# Altium schematic sheet PWR_SEPIC_P12V_N12V.SchDoc: RFSoC_AMC
size 420 x 297 mm; Author: T. Przywozki; CompanyName: WUT ISE; DrawnBy: T. Przywozki; Organization: WUT ISE; Address1: PW ISE; Address2: Nowowiejska 15/19 00-665 Warsaw; Revision: 1.0; SheetNumber: 34; ModifiedBy: -; CheckedDate: -; Title2: 8 channel ADC & DAC; DivGrp: WUT ISE; Designer: T. Przywozki
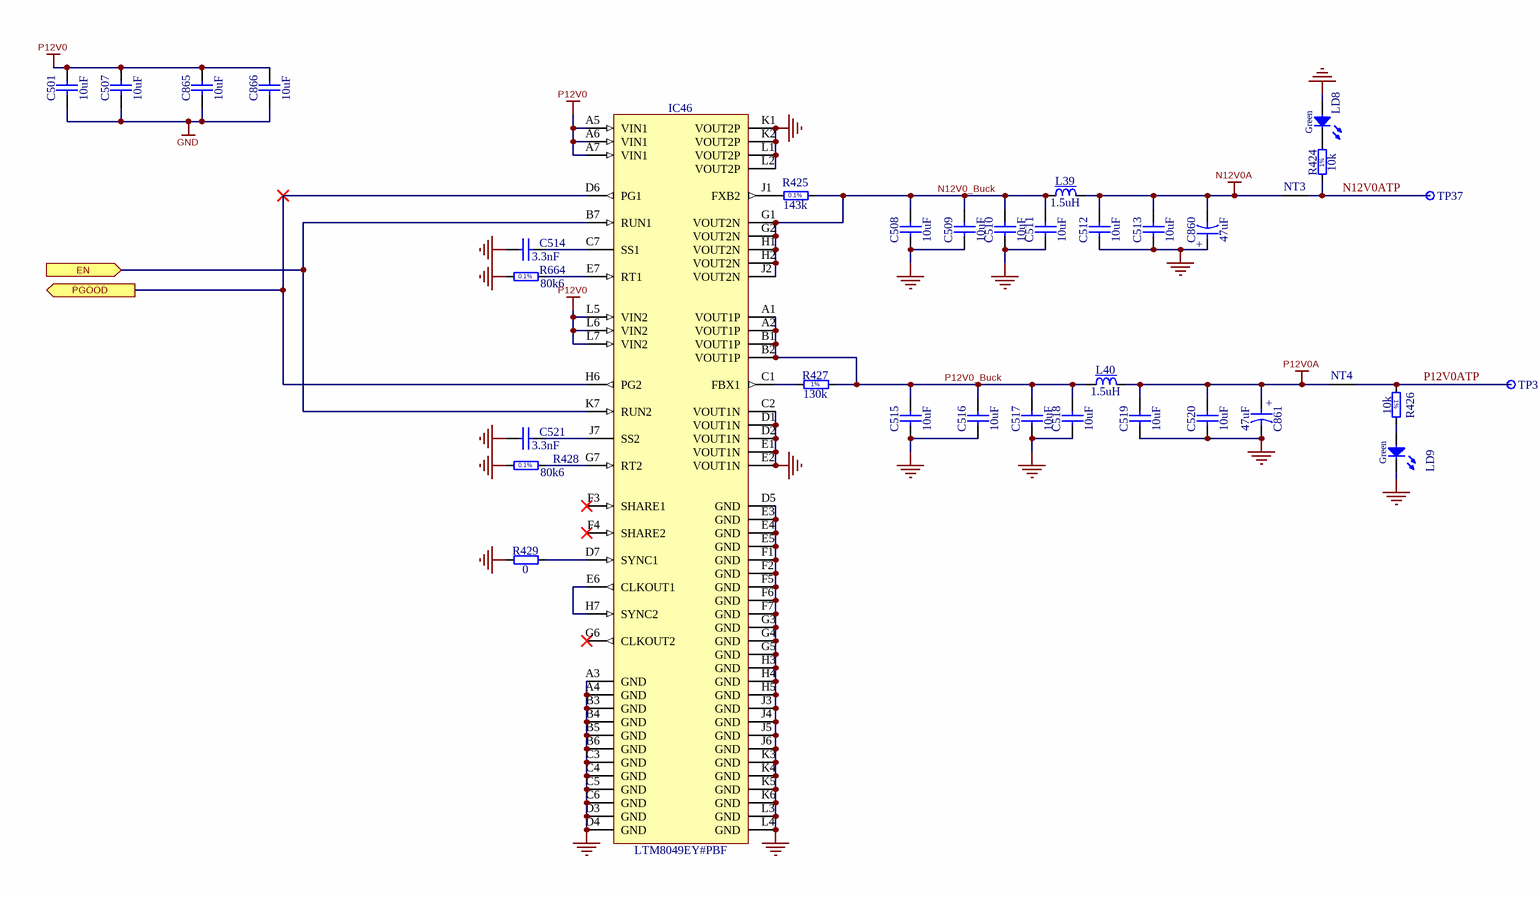
[diagram p0: PWR_SEPIC_P12V_N12V.SchDoc]

## Parts
C501  10uF  [CAPC2012X95N]
C507  10uF  [CAPC2012X95N]
C508  10uF  [CAPC2012X95N]
C509  10uF  [CAPC2012X95N]
C510  10uF  [CAPC2012X95N]
C511  10uF  [CAPC2012X95N]
C512  10uF  [CAPC2012X95N]
C513  10uF  [CAPC2012X95N]
C514  3.3nF  [CAPC1005X55N]
C515  10uF  [CAPC2012X95N]
C516  10uF  [CAPC2012X95N]
C517  10uF  [CAPC2012X95N]
C518  10uF  [CAPC2012X95N]
C519  10uF  [CAPC2012X95N]
C520  10uF  [CAPC2012X95N]
C521  3.3nF  [CAPC1005X55N]
C860  47uF  [CAPMP6032X280N]
C861  47uF  [CAPMP6032X280N]
C865  10uF  [CAPC2012X95N]
C866  10uF  [CAPC2012X95N]
IC46  LTM8049EY#PBF  [BGA77C127P7X11_900X1500X262]
L39  1.5uH  [IND_TDK_SPM6530]
L40  1.5uH  [IND_TDK_SPM6530]
LD8  Green  [LED_KINGBRIGHT_KPH-1608CGCK]
LD9  Green  [LED_KINGBRIGHT_KPH-1608CGCK]
NT3  Net Tie  [Net Tie]  (value not drawn)  (net tie, no BOM)
NT4  Net Tie  [Net Tie]  (value not drawn)  (net tie, no BOM)
R424  10k  [RESC1005X40N]
R425  143k  [RESC1608X55N]
R426  10k  [RESC1005X40N]
R427  130k  [RESC1005X40N]
R428  80k6  [RESC1608X55N]
R429  0  [RESC1005X40N]
R664  80k6  [RESC1608X55N]
TP37  Test Point  [TPS127]  (value not drawn)
TP38  Test Point  [TPS127]  (value not drawn)

## Ports
EN (in), PGOOD (out)

## Nets
GND: C501.1 C507.1 C508.1 C509.1 C510.1 C511.1 C512.1 C513.1 C514.1 C515.1 C516.1 C517.1 C518.1 C519.1 C520.1 C521.1 C860.1 C861.2 C865.1 C866.1 IC46.A3(GND) IC46.A4(GND) IC46.B3(GND) IC46.B4(GND) IC46.B5(GND) IC46.B6(GND) IC46.C2(VOUT1N) IC46.C3(GND) IC46.C4(GND) IC46.C5(GND) IC46.C6(GND) IC46.D1(VOUT1N) IC46.D2(VOUT1N) IC46.D3(GND) IC46.D4(GND) IC46.D5(GND) IC46.E1(VOUT1N) IC46.E2(VOUT1N) IC46.E3(GND) IC46.E4(GND) IC46.E5(GND) IC46.F1(GND) IC46.F2(GND) IC46.F5(GND) IC46.F6(GND) IC46.F7(GND) IC46.G3(GND) IC46.G4(GND) IC46.G5(GND) IC46.H3(GND) IC46.H4(GND) IC46.H5(GND) IC46.J3(GND) IC46.J4(GND) IC46.J5(GND) IC46.J6(GND) IC46.K1(VOUT2P) IC46.K2(VOUT2P) IC46.K3(GND) IC46.K4(GND) IC46.K5(GND) IC46.K6(GND) IC46.L1(VOUT2P) IC46.L2(VOUT2P) IC46.L3(GND) IC46.L4(GND) LD8.2(A) LD9.1(C) R428.1 R429.1 R664.1
N12V0A: C512.2 C513.2 C860.2 L39.2 NT3.1
P12V0: C501.2 C507.2 C865.2 C866.2 IC46.A5(VIN1) IC46.A6(VIN1) IC46.A7(VIN1) IC46.L5(VIN2) IC46.L6(VIN2) IC46.L7(VIN2)
P12V0A: C519.2 C520.2 C861.1 L40.2 NT4.1
EN: IC46.B7(RUN1) IC46.K7(RUN2) ; port EN
N12V0_Buck: C508.2 C509.2 C510.2 C511.2 IC46.G1(VOUT2N) IC46.G2(VOUT2N) IC46.H1(VOUT2N) IC46.H2(VOUT2N) IC46.J2(VOUT2N) L39.1 R425.2
N12V0ATP: NT3.2 R424.1 TP37.1
P12V0_Buck: C515.2 C516.2 C517.2 C518.2 IC46.A1(VOUT1P) IC46.A2(VOUT1P) IC46.B1(VOUT1P) IC46.B2(VOUT1P) L40.1 R427.2
P12V0ATP: NT4.2 R426.1 TP38.1
PGOOD: IC46.D6(PG1) IC46.H6(PG2) ; port PGOOD
NetC514_2: C514.2 IC46.C7(SS1)
NetC521_2: C521.2 IC46.J7(SS2)
NetIC46_C1: IC46.C1(FBX1) R427.1
NetIC46_D7: IC46.D7(SYNC1) R429.2
NetIC46_E6: IC46.E6(CLKOUT1) IC46.H7(SYNC2)
NetIC46_E7: IC46.E7(RT1) R664.2
NetIC46_G7: IC46.G7(RT2) R428.2
NetIC46_J1: IC46.J1(FXB2) R425.1
NetLD8_1: LD8.1(C) R424.2
NetLD9_2: LD9.2(A) R426.2

Not connected (* = marked no-connect by the designer): IC46 F3(SHARE1)* F4(SHARE2)* G6(CLKOUT2)*

## Notes on the sheet
- Project/Equipment
- Document
- Designer
- Drawn by
- Check.by
- Copyright WUT ISE 2019.
  This documentation describes Open Hardware and is licensed under the CERN OHL v.1.1. You may redistribute and modify this documentation under the terms of the CERN OHL v.1.1. (http://ohwr.org/CERNOHL). This documentation is distributed WITHOUT ANY EXPRESS OR IMPLIED WARRANTY, INCLUDING OF MERCHANTABILITY, SATISFACTORY QUALITY AND FITNESS FOR A PARTICULAR PURPOSE. Please see the CERN OHL v.1.1 for applicable conditions.
- Contact
- File
- Last Mod.
- Print Date
- Sheet
- Size
- A3
- of
- Rev
- (in symbol CTE6032-28_47UF_16V_10%_LESR0350) +
- (in symbol R0402_10K_1%_0.0625W_100PPM) 1%
- (in symbol R0402_130K_1%_0.0625W_100PPM) 1%
- (in symbol R0603_80K6_0.1%_0.063W_10PPM) 0.1%
- (in symbol R0603_143K_0.1%_0.063W_10PPM) 0.1%

## Library data of the parts
C501 C507 C865 C866 = CC0805_10UF_25V_10%_X5R: Non-polarised capacitor; Manufacturer: GENERIC; Manufacturer1 Part Number: GRM219R61E106KA12D; Part Description: SMD Multilayer Chip Ceramic Capacitor; TC: X5R; Tolerance: ±10%; Voltage: 25V; Case: 0805; Manufacturer Part Number: CC0805_10UF_25V_10%_X5R; Manufacturer1 Example: MURATA; Part Number: CC0805_10UF_25V_10%_X5R; Pin Count: 2; SMD: Yes; Status: Preferred; Value: 10uF; Component Kind: Standard; Component Type: Standard; Mounted: Yes; Socket: No; Sense: No; Manufacturer1 ComponentHeight: 0.95mm; HelpURL: \\cern.ch\dfs\Applications\Altium\Datasheets\CC0805_X5R_MURATA_GRM.pdf; Author: CERN DEM JLC; CreateDate: 25.10.2012; LatestRevisionDate: 06.09.2016
C508-C513 C515-C520 = CC0805_10UF_25V_10%_X5R: Non-polarised capacitor; Manufacturer: GENERIC; Part Description: SMD Multilayer Chip Ceramic Capacitor; Manufacturer1 Part Number: GRM219R61E106KA12D; Tolerance: ±10%; Voltage: 25V; TC: X5R; Manufacturer Part Number: CC0805_10UF_25V_10%_X5R; Part Number: CC0805_10UF_25V_10%_X5R; Value: 10uF; Component Kind: Standard; Component Type: Standard; Pin Count: 2; Status: Preferred; Case: 0805; Mounted: Yes; Socket: No; SMD: Yes; Sense: No; Manufacturer1 Example: MURATA; Manufacturer1 ComponentHeight: 0.95mm; HelpURL: \\cern.ch\dfs\Applications\Altium\Datasheets\CC0805_X5R_MURATA_GRM.pdf; Author: CERN DEM JLC; CreateDate: 25/10/2012; LatestRevisionDate: 06/09/2016
C514 C521 = CC0402_3.3NF_50V_10%_X7R: Non-polarised capacitor; Manufacturer: GENERIC; Part Description: SMD Multilayer Chip Ceramic Capacitor; Manufacturer1 Part Number: 223858715629; Tolerance: ±10%; Voltage: 50V; TC: X7R; Manufacturer Part Number: CC0402_3.3NF_50V_10%_X7R; Part Number: CC0402_3.3NF_50V_10%_X7R; Value: 3.3nF; Component Kind: Standard; Component Type: Standard; Pin Count: 2; Status: Not Recommended; Case: 0402; Mounted: Yes; Socket: No; SMD: Yes; Sense: No; Manufacturer1 Example: PHYCOMP; Manufacturer1 ComponentHeight: 0.55mm; HelpURL: \\cern.ch\dfs\Applications\Altium\Datasheets\CC0402_X7R_PHYCOMP.pdf; Author: CERN DEM JLC; CreateDate: 03/12/2007; LatestRevisionDate: 03/12/2007
C860 C861 = CTE6032-28_47UF_16V_10%_LESR0350: Polarised capacitor; Manufacturer: GENERIC; Part Description: Low ESR 0R350 Solid Tantalum Chip Capacitor; Manufacturer1 Part Number: TPSC476K016R0350; Tolerance: ±10%; Voltage: 16V; Manufacturer Part Number: CTE6032-28_47UF_16V_10%_LESR0350; Part Number: CTE6032-28_47UF_16V_10%_LESR0350; Value: 47uF; Component Kind: Standard; Component Type: Standard; Pin Count: 2; Status: Preferred; Case: C; Mounted: Yes; Socket: No; SMD: Yes; Sense: No; Manufacturer1 Example: AVX; Manufacturer1 ComponentHeight: 2.8mm; HelpURL: \\cern.ch\dfs\Applications\Altium\Datasheets\CTE-LESR_AVX_TPS.pdf; Author: CERN DEM JLC; CreateDate: 05/05/2008; LatestRevisionDate: 20/01/2009
IC46 = LTM8049EY#PBF: Dual SEPIC or Inverting uModule DC/DC Converter; Manufacturer: LINEAR TECHNOLOGY; PressFit: No; Bonding: No; Part Number: LTM8049EY#PBF; Component Kind: Standard; Component Type: Standard; Device: LTM8049EY#PBF; PackageDescription: BGA, 1.27mm Pitch, Rect.; 77 Pin, 7 Columns X 11 Rows, 9.00mm X 15.00mm X 2.62mm H; Part Description: Dual SEPIC or Inverting uModule DC/DC Converter; Manufacturer Part Number: LTM8049EY#PBF; Pin Count: 77; Case: BGA77; Mounted: Yes; Socket: No; SMD: Yes; Sense: No; ComponentHeight: 2.62mm; HelpURL: \\cern.ch\dfs\Applications\Altium\Datasheets\LTM8049EY#PBF.pdf; Author: CERN DEM JLC; CreateDate: 08.12.2016; LatestRevisionDate: 08.12.2016
L39 L40 = IND_1.5UH_20%_TDK_SPM6530: Inductor With Core; Manufacturer Part Number: SPM6530T-1R5M100; Manufacturer: TDK; Part Description: SMD Inductor for Power Circuits (Wound Metal), SPM Series; Tolerance: ±20%; Power: 11A; Resistance: 0.0097R; Part Number: IND_1.5UH_20%_TDK_SPM6530; Value: 1.5uH; Component Kind: Standard; Component Type: Standard; Pin Count: 2; Status: None; Mounted: Yes; Socket: No; SMD: Yes; Sense: No; ComponentHeight: 3mm; HelpURL: \\cern.ch\dfs\Applications\Altium\Datasheets\IND_TDK_SPM6530.pdf; Author: CERN DEM MR; CreateDate: 08/11/2016; LatestRevisionDate: 08/11/2016
LD8 LD9 = LED_KINGBRIGHT_KPH-1608CGCK: LED Green 1C 2A; Part Description: SMD Green LED, Case 1.6mmX0.8mm(0603), 0.65mm Thickness; PressFit: No; Bonding: No; Part Number: LED_KINGBRIGHT_KPH-1608CGCK; Component Kind: Standard; Component Type: Standard; Color: Green; PackageDescription: SMT Green LED, Case 0603, Body L 1.6 x W 0.8mm H 0.65mm; Manufacturer: KINGBRIGHT; Manufacturer Part Number: KPH-1608CGCK; Pin Count: 2; Mounted: Yes; Socket: No; SMD: Yes; Sense: No; ComponentHeight: 0.65mm; HelpURL: \\cern.ch\dfs\Applications\Altium\Datasheets\LED_KINGBRIGHT_KPH-1608CGCK.pdf; Author: CERN DEM JLC; CreateDate: 03/07/2017; LatestRevisionDate: 03/07/2017
NT3 NT4 = Net Tie: Part Description: Net Tie (2 Nets); Mounted: No; Part Number: Net Tie; Component Type: Net Tie; Pin Count: 2; Family: Net Tie; Socket: No; SMD: No; Sense: No; Status: None; ComponentHeight: 0mm; HelpURL: Undefined; Author: CERN DEM JLC; CreateDate: 22.03.2011; LatestRevisionDate: 22.03.2011; PackageDescription: 2 Plated Through Hole For Coaxial Cable Link: Hole Dia.=1.4mm Pad Dia.=2.5mm
R424 R426 = R0402_10K_1%_0.0625W_100PPM: Resistor - 1%; Manufacturer: GENERIC; Part Description: General Purpose Thick Film Chip Resistor; Manufacturer1 Part Number: 232270671003L; TC: ±100ppm/°C; PressFit: No; Manufacturer Part Number: R0402_10K_1%_0.0625W_100PPM; Part Number: R0402_10K_1%_0.0625W_100PPM; Tolerance: ±1%; Value: 10k; Component Kind: Standard; Component Type: Standard; Pin Count: 2; Status: Not Recommended; Power: 0.0625W; Case: 0402; Mounted: Yes; Sense: No; Socket: No; SMD: Yes; Manufacturer1 Example: YAGEO PHYCOMP; Manufacturer1 ComponentHeight: 0.4mm; HelpURL: \\cern.ch\dfs\Applications\Altium\Datasheets\R0402_Phycomp_RC0402.pdf; Author: CERN DEM JLC; CreateDate: 03/12/2007; LatestRevisionDate: 17/10/2012
R425 = R0603_143K_0.1%_0.063W_10PPM: Resistor - 0.1%; Manufacturer: GENERIC; Part Description: Thin Film Chip Resistor; Manufacturer1 Part Number: RN73C1J143KBTDF; Power: 0.063W; TC: ±10ppm; PressFit: No; Manufacturer Part Number: R0603_143K_0.1%_0.063W_10PPM; Part Number: R0603_143K_0.1%_0.063W_10PPM; Tolerance: ±0.1%; Value: 143k; Component Kind: Standard; Component Type: Standard; Pin Count: 2; Status: Not Recommended; Case: 0603; Mounted: Yes; Sense: No; Socket: No; SMD: Yes; Manufacturer1 Example: TYCO HOLSWORTHY; Manufacturer1 ComponentHeight: 0.5mm; HelpURL: \\cern.ch\dfs\Applications\Altium\Datasheets\R0603_Tyco_RN73.pdf; Author: CERN DEM JLC; CreateDate: 03/12/2007; LatestRevisionDate: 13/03/2008
R427 = R0402_130K_1%_0.0625W_100PPM: Resistor - 1%; Manufacturer: GENERIC; Part Description: General Purpose Thick Film Chip Resistor; Manufacturer1 Part Number: 232270671304L; TC: ±100ppm/°C; PressFit: No; Manufacturer Part Number: R0402_130K_1%_0.0625W_100PPM; Part Number: R0402_130K_1%_0.0625W_100PPM; Tolerance: ±1%; Value: 130k; Component Kind: Standard; Component Type: Standard; Pin Count: 2; Status: Not Recommended; Power: 0.0625W; Case: 0402; Mounted: Yes; Sense: No; Socket: No; SMD: Yes; Manufacturer1 Example: YAGEO PHYCOMP; Manufacturer1 ComponentHeight: 0.4mm; HelpURL: \\cern.ch\dfs\Applications\Altium\Datasheets\R0402_Phycomp_RC0402.pdf; Author: CERN DEM JLC; CreateDate: 03/12/2007; LatestRevisionDate: 17/10/2012
R428 R664 = R0603_80K6_0.1%_0.063W_10PPM: Resistor - 0.1%; Manufacturer: GENERIC; Part Description: Thin Film Chip Resistor; Manufacturer1 Part Number: RN73C1J80K6BTDF; Power: 0.063W; TC: ±10ppm; PressFit: No; Manufacturer Part Number: R0603_80K6_0.1%_0.063W_10PPM; Part Number: R0603_80K6_0.1%_0.063W_10PPM; Tolerance: ±0.1%; Value: 80k6; Component Kind: Standard; Component Type: Standard; Pin Count: 2; Status: Not Recommended; Case: 0603; Mounted: Yes; Sense: No; Socket: No; SMD: Yes; Manufacturer1 Example: TYCO HOLSWORTHY; Manufacturer1 ComponentHeight: 0.5mm; HelpURL: \\cern.ch\dfs\Applications\Altium\Datasheets\R0603_Tyco_RN73.pdf; Author: CERN DEM JLC; CreateDate: 03/12/2007; LatestRevisionDate: 13/03/2008
R429 = R0402_0R_JUMPER: Resistor; Manufacturer: GENERIC; Part Description: 1A (0.05R Max DC Resistance) Zero Ohm Jumper; Manufacturer1 Part Number: 232270591001L; PressFit: No; Manufacturer Part Number: R0402_0R_JUMPER; Part Number: R0402_0R_JUMPER; Value: 0; Component Kind: Standard; Component Type: Standard; Pin Count: 2; Status: Not Recommended; Case: 0402; Mounted: Yes; Sense: No; Socket: No; SMD: Yes; Manufacturer1 Example: YAGEO PHYCOMP; Manufacturer1 ComponentHeight: 0.4mm; HelpURL: \\cern.ch\dfs\Applications\Altium\Datasheets\R0402_Phycomp_RC0402.pdf; Author: CERN DEM JLC; CreateDate: 03/12/2007; LatestRevisionDate: 17/10/2012
TP37 TP38 = SMD_PAD_1.27X1.27MM: Part Description: 1.27mm x 1.27mm PCB Copper Area (SMD Test Point); Mounted: No; ComponentHeight: 0mm; Family: Test Point; Part Number: SMD_PAD_1.27X1.27MM; Pin Count: 1; Sense: No; SMD: Yes; Socket: No; Status: None; Component Kind: Standard (No BOM); Component Type: Standard (No BOM); HelpURL: Undefined; Author: CERN DEM JLC; CreateDate: 12.01.2008; LatestRevisionDate: 12.01.2008; PackageDescription: 1.27mm x 1.27mm PCB Copper Area (SMD Test Point)